# Altium schematic sheet Schema-ruche.SchDoc
size A4
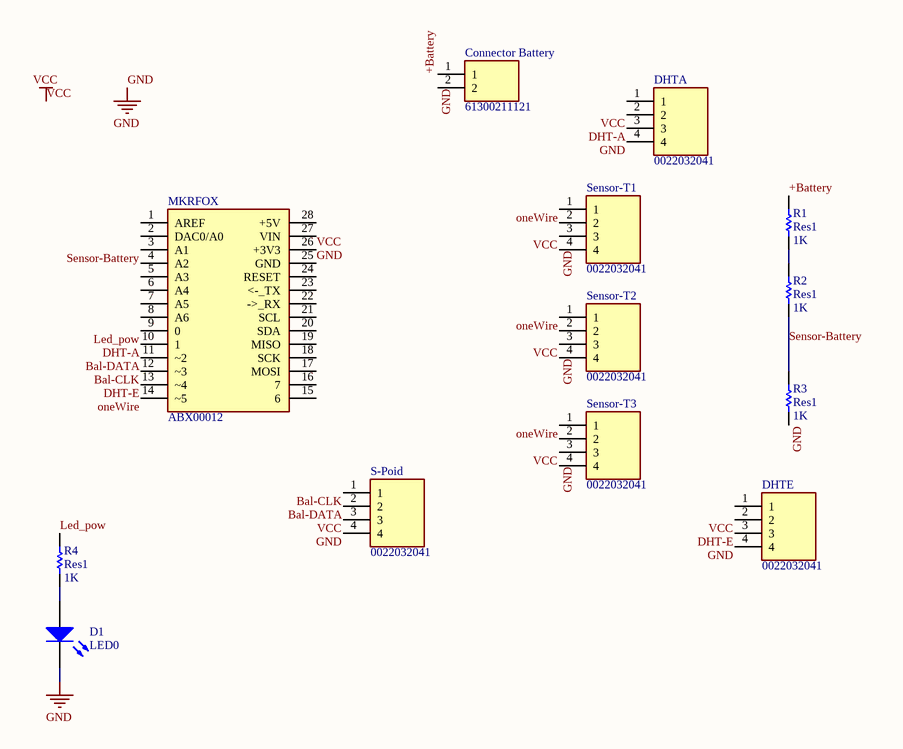
[diagram p0: Schema-ruche.SchDoc]

## Parts
Connector_Battery  61300211121  [HDRV2W110P0X254_1X2_508X254X854P]
D1  LED0  [LED-0]
DHTA  0022032041  [HDRV4W87P0X254_1X4_991X236X1155P]
DHTE  0022032041  [HDRV4W87P0X254_1X4_991X236X1155P]
MKRFOX  ABX00012  [ABX00012]
R1  Res1  value 1K  [AXIAL-0.3]
R2  Res1  value 1K  [AXIAL-0.3]
R3  Res1  value 1K  [AXIAL-0.3]
R4  Res1  value 1K  [AXIAL-0.3]
S-Poid  0022032041  [HDRV4W87P0X254_1X4_991X236X1155P]
Sensor-T1  0022032041  [HDRV4W87P0X254_1X4_991X236X1155P]
Sensor-T2  0022032041  [HDRV4W87P0X254_1X4_991X236X1155P]
Sensor-T3  0022032041  [HDRV4W87P0X254_1X4_991X236X1155P]

## Nets
GND: Connector_Battery.2 D1.2(K) DHTA.4 DHTE.4 MKRFOX.25(GND) R3.1 S-Poid.4 Sensor-T1.4 Sensor-T2.4 Sensor-T3.4
VCC: DHTA.2 DHTE.2 MKRFOX.26(+3V3) S-Poid.3 Sensor-T1.3 Sensor-T2.3 Sensor-T3.3
+Battery: Connector_Battery.1 R1.2
Bal-CLK: MKRFOX.12(~3) S-Poid.1
Bal-DATA: MKRFOX.11(~2) S-Poid.2
DHT-A: DHTA.3 MKRFOX.10(1)
DHT-E: DHTE.3 MKRFOX.13(~4)
Led_pow: MKRFOX.9(0) R4.2
oneWire: MKRFOX.14(~5) Sensor-T1.1 Sensor-T2.1 Sensor-T3.1
Sensor-Battery: MKRFOX.3(A1) R2.1 R3.2
NetD1_1: D1.1(A) R4.1
NetR1_1: R1.1 R2.2

Not connected (* = marked no-connect by the designer): DHTA 1; DHTE 1; MKRFOX 1(AREF) 2(DAC0/A0) 4(A2) 5(A3) 6(A4) 7(A5) 8(A6) 15(6) 16(7) 17(MOSI) 18(SCK) 19(MISO) 20(SDA) 21(SCL) 22(->_RX) 23(<-_TX) 24(RESET) 27(VIN) 28(+5V); Sensor-T1 2; Sensor-T2 2; Sensor-T3 2

## Library data of the parts
Connector_Battery = 61300211121: Connector; Manufacturer_Name: Wurth Elektronik; Datasheet Link: https://componentsearchengine.com/Datasheets/2/61300211121.pdf; Height: 8.54mm; Manufacturer_Part_Number: 61300211121; Mouser Part Number: 710-61300211121; Mouser Price/Stock: https://www.mouser.co.uk/ProductDetail/Wurth-Elektronik/61300211121?qs=t4813l51qx%252B1A5GYDQxPlw%3D%3D
D1 = LED0: Typical INFRARED GaAs LED; Published: 8-Jun-2000; LatestRevisionDate: 08-Jul-2005; LatestRevisionNote: Mech Layer 1 removed.; PackageReference: LED-0; Publisher: Altium Limited; PackageDescription: LED; 2 Leads
DHTA DHTE S-Poid Sensor-T1-Sensor-T3 = 0022032041: Connector; Manufacturer_Name: Molex; Datasheet Link: http://www.molex.com/pdm_docs/sd/022032041_sd.pdf; Height: 11.55mm; Manufacturer_Part_Number: 0022032041; Mouser Part Number: N/A; Mouser Price/Stock: https://www.mouser.co.uk/ProductDetail/Molex/0022032041?qs=PBcRNPEHKsrt5pJfEqGMHQ%3D%3D; Arrow Part Number: 0022032041; Arrow Price/Stock: https://www.arrow.com/en/products/0022032041/molex
MKRFOX = ABX00012: Undefined or Miscellaneous; Manufacturer_Name: Arduino; Datasheet Link: http://media.digikey.com/pdf/Data%20Sheets/Arduino%20PDFs/ABX00012_Web.pdf; Height: 10mm; Manufacturer_Part_Number: ABX00012; Mouser Part Number: 782-ABX00012; Mouser Price/Stock: https://www.mouser.co.uk/ProductDetail/Arduino/ABX00012?qs=5aG0NVq1C4yoL%2F5lAzCrfA%3D%3D; Arrow Part Number: ABX00012; Arrow Price/Stock: https://www.arrow.com/en/products/abx00012/arduino-corporation?region=nac
R1-R4 = Res1: Resistor; Published: 8-Jun-2000; LatestRevisionDate: 17-Jul-2002; LatestRevisionNote: Re-released for DXP Platform.; PackageReference: AXIAL-0.3; Publisher: Altium Limited; PackageDescription: Axial Device, Thru-Hole; 2 Leads; 0.3 in Pin Spacing